# Altium project FoxSense_PCB.PrjPcb
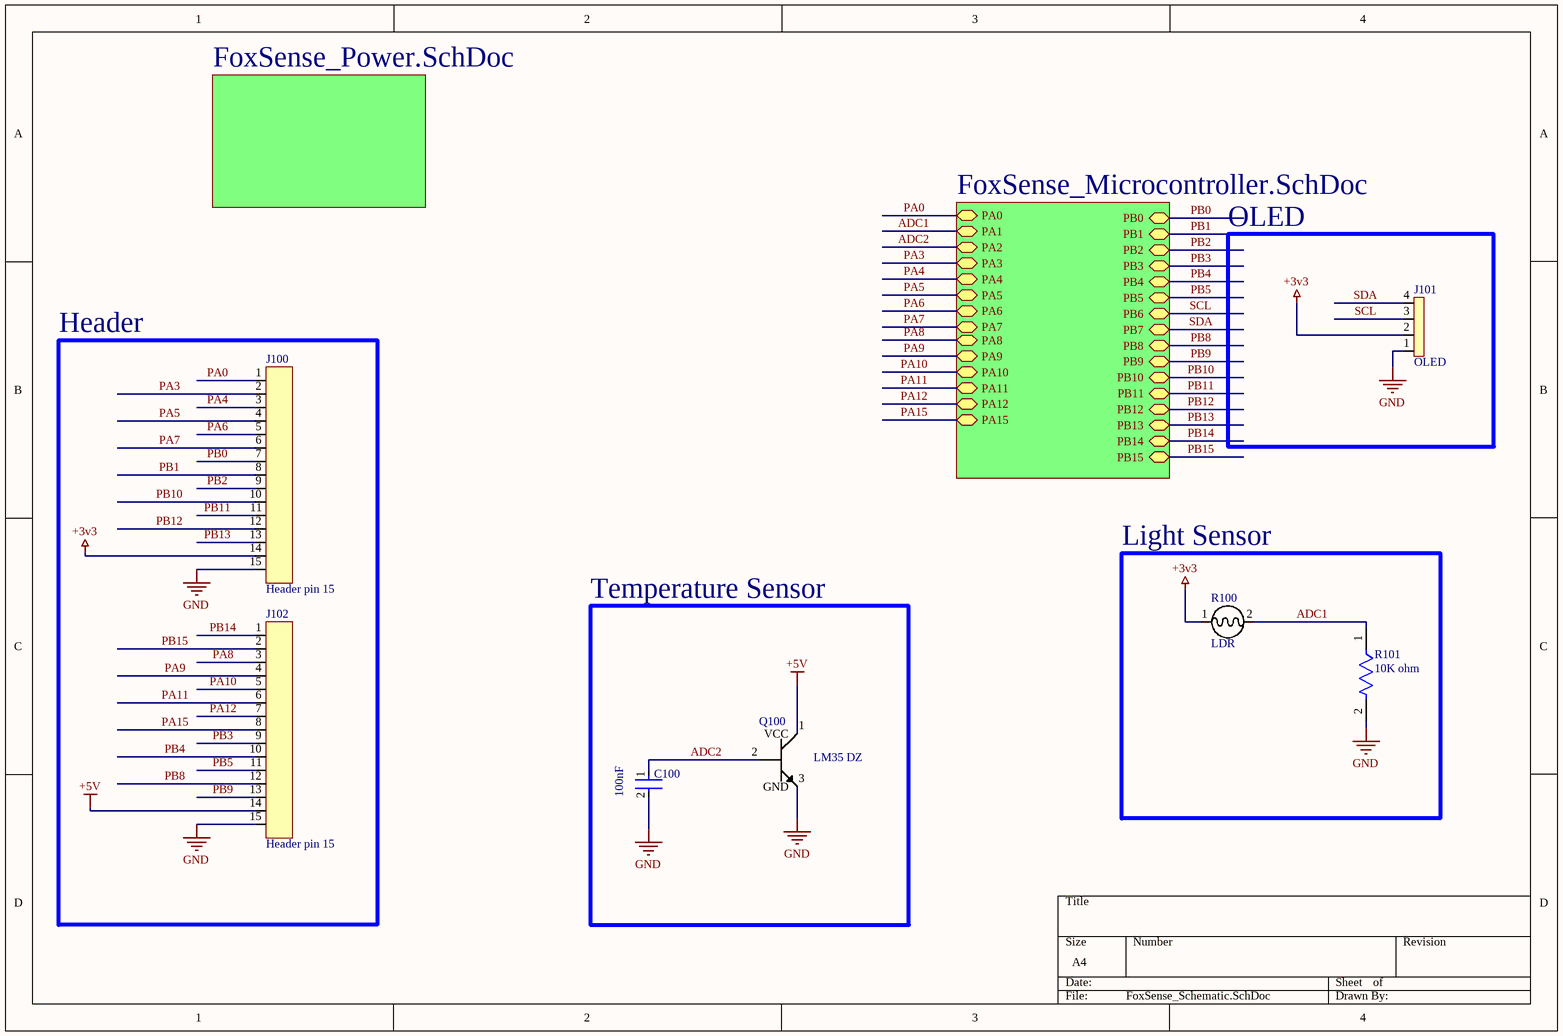
[diagram p0: FoxSense_Schematic.SchDoc]
3 sheets, 35 parts. Net scope: hierarchical (ports join the sheet entries above them; power ports are global).
Board file: FoxSense_PCB.PcbDoc
Sheets:
  FoxSense_Schematic.SchDoc
    U_FoxSense_Power = FoxSense_Power.SchDoc
    U_FoxSense_Microcontroller = FoxSense_Microcontroller.SchDoc

## Sheet FoxSense_Schematic.SchDoc
size A4; SheetNumber: 1; SheetTotal: 3

### Parts
C100  100nF  [Capacitor_SMD_0805]
J100  Header pin 15  [Header15]
J101  OLED  [Header4]
J102  Header pin 15  [Header15]
Q100  LM35 DZ  [LM35]
R100  LDR  [LDR]
R101  10K ohm  [Resistor_SMD_0805]

### Blocks framed on the sheet
OLED: J101
Header: J100 J102
Light Sensor: R100 R101
Temperature Sensor: C100 Q100

### Sub-sheets
U_FoxSense_Microcontroller = FoxSense_Microcontroller.SchDoc: PA0 (bidir), PA1 (bidir), PA2 (bidir), PA3 (bidir), PA4 (bidir), PA5 (bidir), PA6 (bidir), PA7 (bidir), PB0 (bidir), PB1 (bidir), PB2 (bidir), PB10 (bidir), PB11 (bidir), PB12 (bidir), PB13 (bidir), PB14 (bidir), PB15 (bidir), PA8 (bidir), PA9 (bidir), PA10 (bidir), PA11 (bidir), PA12 (bidir), PA15 (bidir), PB3 (bidir), PB4 (bidir), PB5 (bidir), PB6 (bidir), PB7 (bidir), PB8 (bidir), PB9 (bidir)
U_FoxSense_Power = FoxSense_Power.SchDoc: no entries

### Nets
+3v3: J100.14 J101.2 R100.1
+5V: J102.14 Q100.1(VCC)
GND: C100.2 J100.15 J101.1 J102.15 Q100.3(GND) R101.2
ADC1: R100.2 R101.1 ; sheet U_FoxSense_Microcontroller/PA1
ADC2: C100.1 Q100.2 ; sheet U_FoxSense_Microcontroller/PA2
PA0: J100.1 ; sheet U_FoxSense_Microcontroller/PA0
PA3: J100.2 ; sheet U_FoxSense_Microcontroller/PA3
PA4: J100.3 ; sheet U_FoxSense_Microcontroller/PA4
PA5: J100.4 ; sheet U_FoxSense_Microcontroller/PA5
PA6: J100.5 ; sheet U_FoxSense_Microcontroller/PA6
PA7: J100.6 ; sheet U_FoxSense_Microcontroller/PA7
PA8: J102.3 ; sheet U_FoxSense_Microcontroller/PA8
PA9: J102.4 ; sheet U_FoxSense_Microcontroller/PA9
PA10: J102.5 ; sheet U_FoxSense_Microcontroller/PA10
PA11: J102.6 ; sheet U_FoxSense_Microcontroller/PA11
PA12: J102.7 ; sheet U_FoxSense_Microcontroller/PA12
PA15: J102.8 ; sheet U_FoxSense_Microcontroller/PA15
PB0: J100.7 ; sheet U_FoxSense_Microcontroller/PB0
PB1: J100.8 ; sheet U_FoxSense_Microcontroller/PB1
PB2: J100.9 ; sheet U_FoxSense_Microcontroller/PB2
PB3: J102.9 ; sheet U_FoxSense_Microcontroller/PB3
PB4: J102.10 ; sheet U_FoxSense_Microcontroller/PB4
PB5: J102.11 ; sheet U_FoxSense_Microcontroller/PB5
PB8: J102.12 ; sheet U_FoxSense_Microcontroller/PB8
PB9: J102.13 ; sheet U_FoxSense_Microcontroller/PB9
PB10: J100.10 ; sheet U_FoxSense_Microcontroller/PB10
PB11: J100.11 ; sheet U_FoxSense_Microcontroller/PB11
PB12: J100.12 ; sheet U_FoxSense_Microcontroller/PB12
PB13: J100.13 ; sheet U_FoxSense_Microcontroller/PB13
PB14: J102.1 ; sheet U_FoxSense_Microcontroller/PB14
PB15: J102.2 ; sheet U_FoxSense_Microcontroller/PB15
SCL: J101.3 ; sheet U_FoxSense_Microcontroller/PB6
SDA: J101.4 ; sheet U_FoxSense_Microcontroller/PB7

### Library data of the parts
C100 = Capacitor_SMD_0805: capacitor smd 0805 100nF
J100 J102 = Header15
J101 = Header4: OLED 0..96 inch
Q100 = LM35
R100 = LDR: LDR DIP
R101 = Resistor_SMD_0805: Resistor SMD 0805 10 k ohm

## Sheet FoxSense_Power.SchDoc
size A4; SheetNumber: 2; SheetTotal: 2
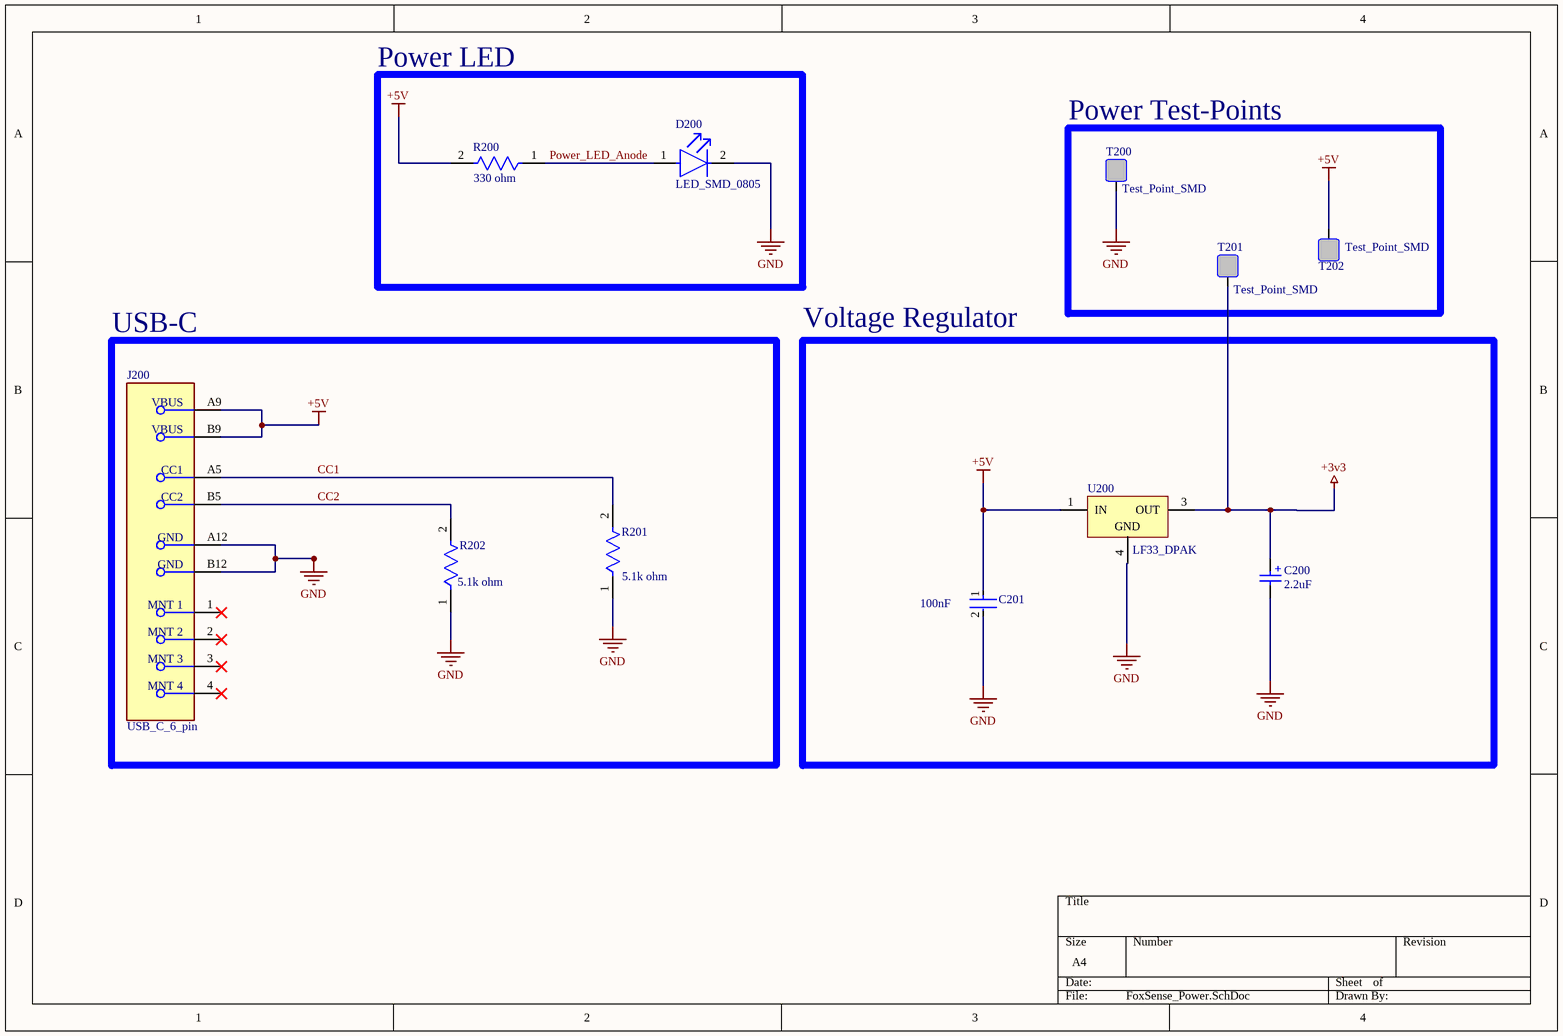
[diagram p1: FoxSense_Power.SchDoc]

### Parts
C200  2.2uF  [Capacitor_SMD_Electrolyte_2.2uF]
C201  100nF  [Capacitor_SMD_0805]
D200  LED_SMD_0805  [LED_SMD_0805]
J200  USB_C_6_pin  [USB_C_6_pin]
R200  330 ohm  [Resistor_SMD_0805]
R201  5.1k ohm  [Resistor_SMD_0805]
R202  5.1k ohm  [Resistor_SMD_0805]
T200  Test_Point_SMD  [TEST_Point_SMD]
T201  Test_Point_SMD  [TEST_Point_SMD]
T202  Test_Point_SMD  [TEST_Point_SMD]
U200  LF33_DPAK  [LF33]

### Blocks framed on the sheet
Power LED: D200 R200
Power Test-Points: T200-T202
USB-C: J200 R201 R202
Voltage Regulator: C200 C201 U200

### Nets
+3v3: C200.1(P) T201.1 U200.3(OUT)
+5V: C201.1 J200.A9(VBUS) J200.B9(VBUS) R200.2 T202.1 U200.1(IN)
GND: C200.2(N) C201.2 D200.2(C) J200.A12(GND) J200.B12(GND) R201.1 R202.1 T200.1 U200.4(GND)
CC1: J200.A5(CC1) R201.2
CC2: J200.B5(CC2) R202.2
Power_LED_Anode: D200.1(A) R200.1

Not connected (* = marked no-connect by the designer): J200 1(MNT_1)* 2(MNT_2)* 3(MNT_3)* 4(MNT_4)*

### Notes on the sheet
- (in symbol Capacitor_SMD_Electrolyte_2.2uF) +

### Library data of the parts
C200 = Capacitor_SMD_Electrolyte_2.2uF: Capacitor SMD Electrolyte 2.2uF
C201 = Capacitor_SMD_0805: capacitor smd 0805
D200 = LED_SMD_0805: LED SMD 0805
J200 = USB_C: USB C connector 6 pin
R200-R202 = Resistor_SMD_0805: Resistor SMD 0805
T200-T202 = Test_Point_SMD: Test Point SMD
U200 = LF33: LF33 DPAK 3.3 voltage regulator

## Sheet FoxSense_Microcontroller.SchDoc
size A4; SheetNumber: 3; SheetTotal: 3
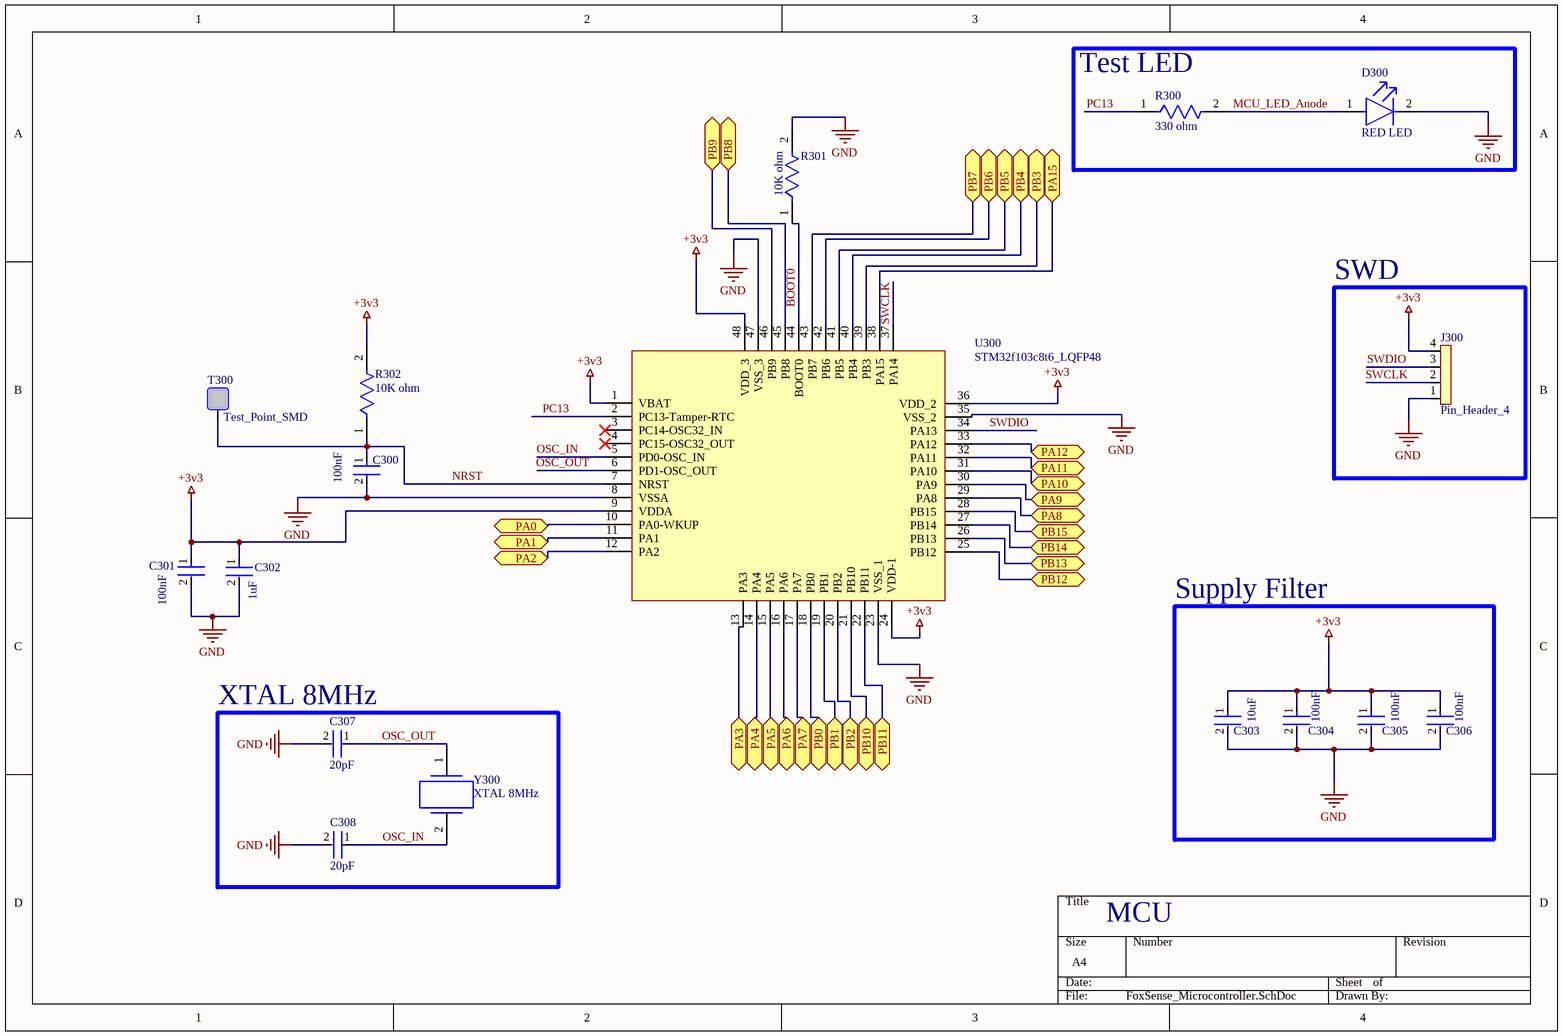
[diagram p2: FoxSense_Microcontroller.SchDoc]

### Parts
C300  100nF  [Capacitor_SMD_0805]
C301  100nF  [Capacitor_SMD_0805]
C302  1uF  [Capacitor_SMD_0805]
C303  10uF  [Capacitor_SMD_0805]
C304  100nF  [Capacitor_SMD_0805]
C305  100nF  [Capacitor_SMD_0805]
C306  100nF  [Capacitor_SMD_0805]
C307  20pF  [Capacitor_SMD_0805]
C308  20pF  [Capacitor_SMD_0805]
D300  RED LED  [LED_SMD_0805]
J300  Pin_Header_4  [Header4]
R300  330 ohm  [Resistor_SMD_0805]
R301  10K ohm  [Resistor_SMD_0805]
R302  10K ohm  [Resistor_SMD_0805]
T300  Test_Point_SMD  [TEST_Point_SMD]
U300  STM32f103c8t6_LQFP48  [STM32f103c8t6_LQFP48]
Y300  XTAL 8MHz  [Crystal_Resonator_SMD_XTAL]

### Blocks framed on the sheet
Test LED: D300 R300
SWD: J300
Supply Filter: C303-C306
XTAL 8MHz: C307 C308 Y300

### Ports
PA0 (bidir, see FoxSense_Schematic[2A]), PA1 (bidir, see FoxSense_Schematic[2B]), PA2 (bidir, see FoxSense_Schematic[2B]), PA3 (bidir, see FoxSense_Schematic[2B]), PA4 (bidir, see FoxSense_Schematic[2B]), PA5 (bidir, see FoxSense_Schematic[2B]), PA6 (bidir, see FoxSense_Schematic[2B]), PA7 (bidir, see FoxSense_Schematic[2B]), PA8 (bidir, see FoxSense_Schematic[2B]), PA9 (bidir, see FoxSense_Schematic[2B]), PA10 (bidir, see FoxSense_Schematic[2B]), PA11 (bidir, see FoxSense_Schematic[2B]), PA12 (bidir, see FoxSense_Schematic[2B]), PA15 (bidir, see FoxSense_Schematic[2B]), PB0 (bidir, see FoxSense_Schematic[3A]), PB1 (bidir, see FoxSense_Schematic[3B]), PB2 (bidir, see FoxSense_Schematic[3B]), PB3 (bidir, see FoxSense_Schematic[3B]), PB4 (bidir, see FoxSense_Schematic[3B]), PB5 (bidir, see FoxSense_Schematic[3B]), PB6 (bidir, see FoxSense_Schematic[3B]), PB7 (bidir, see FoxSense_Schematic[3B]), PB8 (bidir, see FoxSense_Schematic[3B]), PB9 (bidir, see FoxSense_Schematic[3B]), PB10 (bidir, see FoxSense_Schematic[3B]), PB11 (bidir, see FoxSense_Schematic[3B]), PB12 (bidir, see FoxSense_Schematic[3B]), PB13 (bidir, see FoxSense_Schematic[3B]), PB14 (bidir, see FoxSense_Schematic[3B]), PB15 (bidir, see FoxSense_Schematic[3B])

### Nets
+3v3: C301.1 C302.1 C303.1 C304.1 C305.1 C306.1 J300.4 R302.2 U300.1(VBAT) U300.9(VDDA) U300.24(VDD-1) U300.36(VDD_2) U300.48(VDD_3)
GND: C300.2 C301.2 C302.2 C303.2 C304.2 C305.2 C306.2 C307.2 C308.2 D300.2(C) J300.1 R301.2 U300.8(VSSA) U300.23(VSS_1) U300.35(VSS_2) U300.47(VSS_3)
ADC1: U300.11(PA1) ; port PA1
ADC2: U300.12(PA2) ; port PA2
BOOT0: R301.1 U300.44(BOOT0)
MCU_LED_Anode: D300.1(A) R300.2
NRST: C300.1 R302.1 T300.1 U300.7(NRST)
OSC_IN: C308.1 U300.5(PD0-OSC_IN) Y300.2
OSC_OUT: C307.1 U300.6(PD1-OSC_OUT) Y300.1
PA0: U300.10(PA0-WKUP) ; port PA0
PA3: U300.13(PA3) ; port PA3
PA4: U300.14(PA4) ; port PA4
PA5: U300.15(PA5) ; port PA5
PA6: U300.16(PA6) ; port PA6
PA7: U300.17(PA7) ; port PA7
PA8: U300.29(PA8) ; port PA8
PA9: U300.30(PA9) ; port PA9
PA10: U300.31(PA10) ; port PA10
PA11: U300.32(PA11) ; port PA11
PA12: U300.33(PA12) ; port PA12
PA15: U300.38(PA15) ; port PA15
PB0: U300.18(PB0) ; port PB0
PB1: U300.19(PB1) ; port PB1
PB2: U300.20(PB2) ; port PB2
PB3: U300.39(PB3) ; port PB3
PB4: U300.40(PB4) ; port PB4
PB5: U300.41(PB5) ; port PB5
PB8: U300.45(PB8) ; port PB8
PB9: U300.46(PB9) ; port PB9
PB10: U300.21(PB10) ; port PB10
PB11: U300.22(PB11) ; port PB11
PB12: U300.25(PB12) ; port PB12
PB13: U300.26(PB13) ; port PB13
PB14: U300.27(PB14) ; port PB14
PB15: U300.28(PB15) ; port PB15
PC13: R300.1 U300.2(PC13-Tamper-RTC)
SCL: U300.42(PB6) ; port PB6
SDA: U300.43(PB7) ; port PB7
SWCLK: J300.2 U300.37(PA14)
SWDIO: J300.3 U300.34(PA13)

Not connected (* = marked no-connect by the designer): U300 3(PC14-OSC32_IN)* 4(PC15-OSC32_OUT)*

### Notes on the sheet
- MCU

### Library data of the parts
C300 C301 C304-C306 = Capacitor_SMD_0805: capacitor smd 0805 100nF
C302 = Capacitor_SMD_0805: capacitor smd 0805
C303 = Capacitor_SMD_0805: capacitor smd 0805 10uF
C307 C308 = Capacitor_SMD_0805: capacitor smd 0805 20pF
D300 = LED_SMD_0805: LED SMD 0805
J300 = Header4: Pin Header 4
R300 = Resistor_SMD_0805: Resistor SMD 0805 330 ohm
R301 R302 = Resistor_SMD_0805: Resistor SMD 0805 10k ohm
T300 = Test_Point_SMD: Test Point SMD
U300 = STM32f103c8t6: STM32f103c8t6 LQFP48
Y300 = Crystal Resonator SMD: crystal resonator SMD 8MHz

## Nets that join several sheets
+3v3: FoxSense_Schematic (J100.14 J101.2 R100.1), FoxSense_Power (C200.1 T201.1 U200.3), FoxSense_Microcontroller (13 pins)
+5V: FoxSense_Schematic (J102.14 Q100.1), FoxSense_Power (6 pins)
GND: FoxSense_Schematic (6 pins), FoxSense_Power (9 pins), FoxSense_Microcontroller (16 pins)
ADC1: FoxSense_Schematic (R100.2 R101.1), FoxSense_Microcontroller (U300.11)
ADC2: FoxSense_Schematic (C100.1 Q100.2), FoxSense_Microcontroller (U300.12)
PA0: FoxSense_Schematic (J100.1), FoxSense_Microcontroller (U300.10)
PA3: FoxSense_Schematic (J100.2), FoxSense_Microcontroller (U300.13)
PA4: FoxSense_Schematic (J100.3), FoxSense_Microcontroller (U300.14)
PA5: FoxSense_Schematic (J100.4), FoxSense_Microcontroller (U300.15)
PA6: FoxSense_Schematic (J100.5), FoxSense_Microcontroller (U300.16)
PA7: FoxSense_Schematic (J100.6), FoxSense_Microcontroller (U300.17)
PA8: FoxSense_Schematic (J102.3), FoxSense_Microcontroller (U300.29)
PA9: FoxSense_Schematic (J102.4), FoxSense_Microcontroller (U300.30)
PA10: FoxSense_Schematic (J102.5), FoxSense_Microcontroller (U300.31)
PA11: FoxSense_Schematic (J102.6), FoxSense_Microcontroller (U300.32)
PA12: FoxSense_Schematic (J102.7), FoxSense_Microcontroller (U300.33)
PA15: FoxSense_Schematic (J102.8), FoxSense_Microcontroller (U300.38)
PB0: FoxSense_Schematic (J100.7), FoxSense_Microcontroller (U300.18)
PB1: FoxSense_Schematic (J100.8), FoxSense_Microcontroller (U300.19)
PB2: FoxSense_Schematic (J100.9), FoxSense_Microcontroller (U300.20)
PB3: FoxSense_Schematic (J102.9), FoxSense_Microcontroller (U300.39)
PB4: FoxSense_Schematic (J102.10), FoxSense_Microcontroller (U300.40)
PB5: FoxSense_Schematic (J102.11), FoxSense_Microcontroller (U300.41)
PB8: FoxSense_Schematic (J102.12), FoxSense_Microcontroller (U300.45)
PB9: FoxSense_Schematic (J102.13), FoxSense_Microcontroller (U300.46)
PB10: FoxSense_Schematic (J100.10), FoxSense_Microcontroller (U300.21)
PB11: FoxSense_Schematic (J100.11), FoxSense_Microcontroller (U300.22)
PB12: FoxSense_Schematic (J100.12), FoxSense_Microcontroller (U300.25)
PB13: FoxSense_Schematic (J100.13), FoxSense_Microcontroller (U300.26)
PB14: FoxSense_Schematic (J102.1), FoxSense_Microcontroller (U300.27)
PB15: FoxSense_Schematic (J102.2), FoxSense_Microcontroller (U300.28)
SCL: FoxSense_Schematic (J101.3), FoxSense_Microcontroller (U300.42)
SDA: FoxSense_Schematic (J101.4), FoxSense_Microcontroller (U300.43)